# Altium schematic sheet SensWear_SWD.SchDoc
size A4; DocumentNumber: 5; SheetNumber: 5; SheetTotal: 5
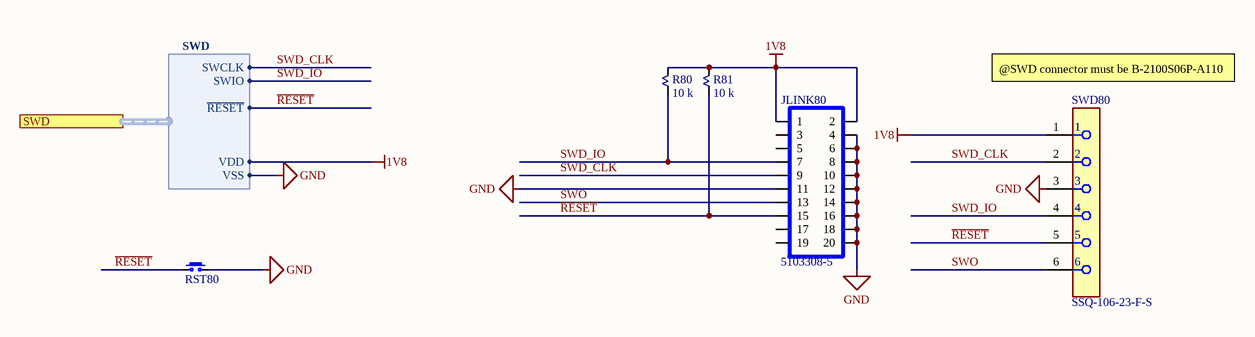
[diagram p0: SensWear_SWD.SchDoc]

## Parts
JLINK80  5103308-5  [TE_5103308-5]
R80  10 k  [RESC1005X04N]
R81  10 k  [RESC1005X04N]
RST80  B3U-1000P  [B3U-1000P]  (value not drawn)
SWD80  SSQ-106-23-F-S  [FP-SSQ-106-23-F-S-MFG]

## Ports
SWD (harness SWD)

## Harnesses
SWD: SWCLK, SWIO, ~{RESET}, VDD, VSS

## Nets
1V8: JLINK80.1 JLINK80.2 R80.2 R81.2 SWD80.1 ; port SWD.VDD
GND: JLINK80.4 JLINK80.6 JLINK80.8 JLINK80.10 JLINK80.11 JLINK80.12 JLINK80.14 JLINK80.16 JLINK80.18 JLINK80.20 RST80.2 SWD80.3 ; port SWD.VSS
~{RESET}: JLINK80.15 R81.1 RST80.1 SWD80.5 ; port SWD.~{RESET}
SWD_CLK: JLINK80.9 SWD80.2 ; port SWD.SWCLK
SWD_IO: JLINK80.7 R80.1 SWD80.4 ; port SWD.SWIO
SWO: JLINK80.13 SWD80.6

Not connected (* = marked no-connect by the designer): JLINK80 3 5 17 19

## Notes on the sheet
- @SWD connector must be B-2100S06P-A110 to be purchased from JLCPCB
- Designer/Engineer
- Drawn By
- Document Name
- Board Title
- Sheet
- of
- Size
- A4
- Approved By
- Rev.
- Date

## Library data of the parts
JLINK80 = 5103308-5: Header; Pin; Vertical; Copper Alloy; Thermoplastic; 20; 0.100 x 0.100 in.; 1 A; Manufacturer: AMP - TE CONNECTIVITY; Supplier 1: Digi-Key; Manufacturer Part Number: 5103308-5; RoHS: No; Category: Headers and Wire Housings; Stock 1: 6694; Pricing 1: 1=2.15000, 10=1.94800, 100=1.66990, 500=1.39158, 1000=1.19279, 5000=1.05760, 10000=1.03375 (USD); ComponentLink1URL: http://catalog.tycoelectronics.com/TE/bin/TE.Connect?C=1&M=BYPN&TCPN=5103308-5&RQPN=5103308-5&src-supplier=Farnell; ComponentLink1Description: http://catalog.tycoelectronics.com/TE/bin/TE.Connect?C=1&M=BYPN&TCPN=5103308-5&RQPN=5103308-5&src-supplier=Farnell; Supplier Part Number 1: A33165-ND; ComponentLink2URL: http://catalog.tycoelectronics.com/TE/bin/TE.Connect?C=1&M=BYPN&TCPN=5103308-5&RQPN=5103308-5&src-supplier=Newark; ComponentLink2Description: http://catalog.tycoelectronics.com/TE/bin/TE.Connect?C=1&M=BYPN&TCPN=5103308-5&RQPN=5103308-5&src-supplier=Newark; ComponentLink3URL: https://www.te.com/commerce/DocumentDelivery/DDEController?Action=srchrtrv&DocNm=5103308&DocType=Customer+Drawing&DocLang=English&src-supplier=Digi-Key; ComponentLink3Description: https://www.te.com/commerce/DocumentDelivery/DDEController?Action=srchrtrv&DocNm=5103308&DocType=Customer+Drawing&DocLang=English&src-supplier=Digi-Key
R80 R81 = ERJ-2RKF1002X: RES SMD 10K OHM 1% 1/10W 0402; Manufacturer: Panasonic Electronic Components; Power (Watts): 0.1W, 1/10W; Temperature Coefficient: ±100ppm/°C; Supplier 1: Digi-Key; Manufacturer Part Number: ERJ-2RKF1002X; RoHS: RoHS Compliant; Category: Resistors; Stock 1: 8105773; Pricing 1: 1=0.1, 10=0.025, 25=0.018, 50=0.0136, 100=0.01, 250=0.00764, 500=0.00612, 1000=0.00451, 5000=0.00323 (USD); Packaging: Digi-Reel®; Part Status: Active; Resistance (Ohms): 10k; Tolerance: ±1%; Composition: Thick Film; Features: Automotive AEC-Q200; Operating Temperature: -55°C ~ 155°C; Package / Case: 0402 (1005 Metric); Supplier Device Package: 0402; Size / Dimension: 0.039" L x 0.020" W (1.00mm x 0.50mm); Height - Seated (Max): 0.016" (0.40mm); Number of Terminations: 2; Failure Rate: -; ComponentLink1URL: https://industrial.panasonic.com/cdbs/www-data/pdf/RDA0000/AOA0000C283.pdf; ComponentLink1Description: https://industrial.panasonic.com/cdbs/www-data/pdf/RDA0000/AOA0000C283.pdf; Supplier Part Number 1: P10.0KLDKR-ND; Value: 10 k
RST80 = B3U-1000P: SWITCH TACTILE SPST-NO 0.05A 12V; Manufacturer: Omron Electronics Inc-EMC Div; Switch Function: Off-Mom; Contact Rating @ Voltage: 0.05A @ 12VDC; Actuator Type: Standard; Actuator Height off PCB, from Pins: 1.60mm; Actuator Orientation: Top Actuated; Outline: 3.00mm x 2.50mm; Illumination: Non-Illuminated; Operating Force: 153gf; Ingress Protection: Dust Proof; Switch Travel: 0.15mm; Mechanical Life: 200,000 Cycles; Supplier 1: Digi-Key; Manufacturer Part Number: B3U-1000P; RoHS: RoHS Compliant; Category: Switches; Stock 1: 66079; Pricing 1: 1=0.93, 10=0.898, 25=0.8468, 50=0.745, 100=0.6774, 250=0.64348, 500=0.62656, 1000=0.49108 (GBP); Packaging: Digi-Reel®; Part Status: Active; Circuit: SPST-NO; Mounting Type: Surface Mount; Termination Style: SMD (SMT) Tab; Illumination Voltage (Nominal): -; Illumination Type, Color: -; Features: -; Actuator Material: -; Operating Temperature: -25°C ~ 70°C; ComponentLink1URL: http://www.omron.com/ecb/products/pdf/en-b3u.pdf; ComponentLink1Description: http://www.omron.com/ecb/products/pdf/en-b3u.pdf; Supplier Part Number 1: SW1020DKR-ND
SWD80 = SSQ-106-23-F-S: Headers & Wire Housings Tiger Buy Socket Strip with Square Tails, 0.100 Pitch; Manufacturer: Samtec; Gender: Receptacle; Number of Contacts: 6; Pitch: 2.54mm; Supplier: Digikey; Supplier Part Number: SSQ-106-23-F-S-ND; Manufacturer Part Number: SSQ-106-23-F-S; RoHS: Yes; Category: Headers and Wire Housings; Stock: 84; Pricing: 1=1.54, 50=1.2, 100=0.97, 500=0.82, 1000=0.775 (USD); Mounting Technology: Through Hole; Contact Plating: Gold; Contact Material: Bronze; Packaging: Bulk; Number of Rows: 1; Termination: Solder; Series: SSQ; Radiation Hardening: No; Lead Free: Lead Free; RoHS Compliant: Yes; Reach SVHC Compliant: No; ComponentLink1URL: ftp://ftp.samtec.com/webfiles/PDF/SSQ_TH.PDF?src-supplier=Avnet; ComponentLink1Description: ftp://ftp.samtec.com/webfiles/PDF/SSQ_TH.PDF?src-supplier=Avnet; Supplier 1: Digikey; Supplier Part Number 1: SSQ-106-23-F-S-ND